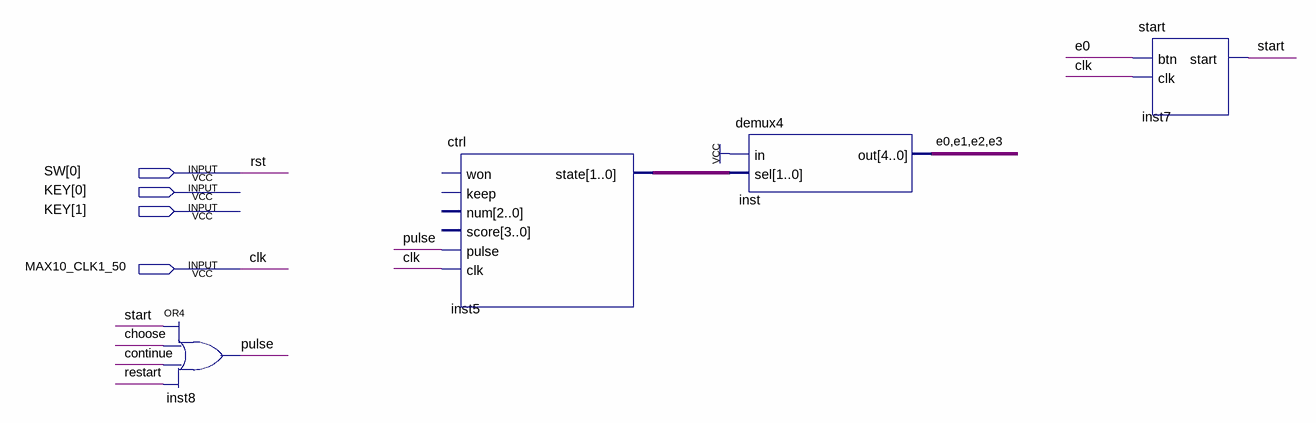
[diagram p0: schematic sheet]
// Quartus schematic 6.bdf as structural Verilog: 4 symbols, 4 pins
module \6  (
  input  [0:0] SW,
  input  [1:0] KEY,
  input  MAX10_CLK1_50
);

  wire choose, \continue , e0, e1, e2, e3, pulse, restart, start;
  wire [1:0] inst5_state;

  or inst8 (pulse, start, choose, \continue , restart);
  ctrl inst5 (.pulse(pulse), .clk(MAX10_CLK1_50), .state(inst5_state));  // open: won, keep, num, score
  demux4 inst (.in(1'b1), .sel(inst5_state), .out({e0, e1, e2, e3}));
  start inst7 (.btn(e0), .clk(MAX10_CLK1_50), .start(start));

  // Other names for the same wires on the sheet: clk = MAX10_CLK1_50; rst = SW[0]
endmodule
